# EAGLE design mowbot (EAGLE 7.6.0)

## Sheet 1 of 2
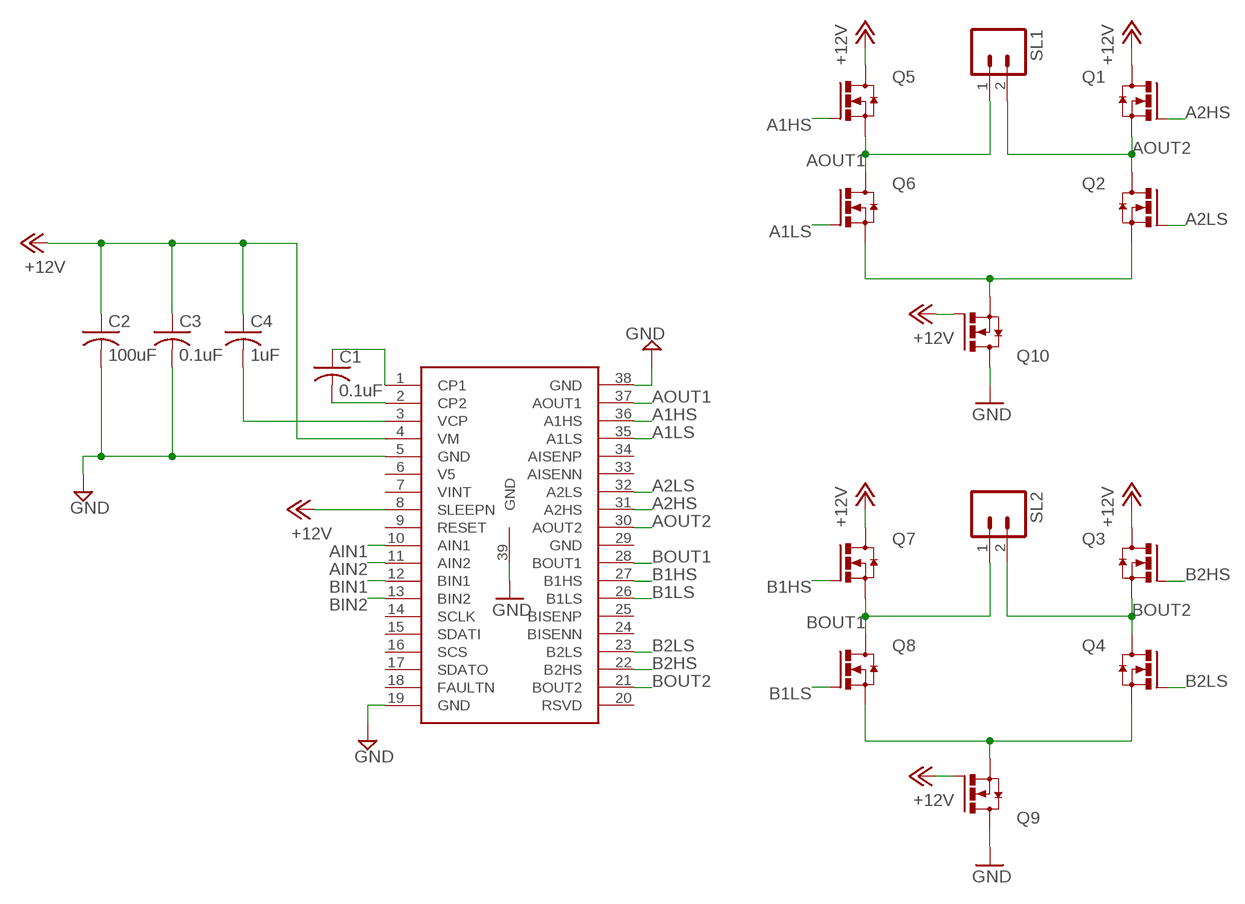
[diagram p0: schematic, sheet 1]

### Parts
C1  0.1uF  C-USC0603  [C0603]
C2  100uF  C-USC0603  [C0603]
C3  0.1uF  C-USC0603  [C0603]
C4  1uF  C-USC0603  [C0603]
Q1  PSMN9R1-30YL-MOSFET_N  [SOT669]
Q2  PSMN9R1-30YL-MOSFET_N  [SOT669]
Q3  PSMN9R1-30YL-MOSFET_N  [SOT669]
Q4  PSMN9R1-30YL-MOSFET_N  [SOT669]
Q5  PSMN9R1-30YL-MOSFET_N  [SOT669]
Q6  PSMN9R1-30YL-MOSFET_N  [SOT669]
Q7  PSMN9R1-30YL-MOSFET_N  [SOT669]
Q8  PSMN9R1-30YL-MOSFET_N  [SOT669]
Q9  PSMN9R1-30YL-MOSFET_N  [SOT669]
Q10  PSMN9R1-30YL-MOSFET_N  [SOT669]
SL1  M02  [02P]
SL2  M02  [02P]
U$1  DRV8704-HBRIDGE_DRIVER  [DRV8704-HBRIDGE-DRIVER]

### Nets
+12V: C2.1 C3.1 C4.1 Q1.MB(D) Q3.MB(D) Q5.MB(D) Q7.MB(D) Q9.4(G) Q10.4(G) U$1.4(VM) U$1.8(SLEEPN) ; also sheet 2
A1HS: Q5.4(G) U$1.36(A1HS)
A1LS: Q6.4(G) U$1.35(A1LS)
A2HS: Q1.4(G) U$1.31(A2HS)
A2LS: Q2.4(G) U$1.32(A2LS)
AIN1: U$1.10(AIN1) ; also sheet 2
AIN2: U$1.11(AIN2) ; also sheet 2
AOUT1: Q5.1(S) Q5.2(S) Q5.3(S) Q6.MB(D) SL1.1 U$1.37(AOUT1)
AOUT2: Q1.1(S) Q1.2(S) Q1.3(S) Q2.MB(D) SL1.2 U$1.30(AOUT2)
B1HS: Q7.4(G) U$1.27(B1HS)
B1LS: Q8.4(G) U$1.26(B1LS)
B2HS: Q3.4(G) U$1.22(B2HS)
B2LS: Q4.4(G) U$1.23(B2LS)
BIN1: U$1.12(BIN1) ; also sheet 2
BIN2: U$1.13(BIN2) ; also sheet 2
BOUT1: Q7.1(S) Q7.2(S) Q7.3(S) Q8.MB(D) SL2.1 U$1.28(BOUT1)
BOUT2: Q3.1(S) Q3.2(S) Q3.3(S) Q4.MB(D) SL2.2 U$1.21(BOUT2)
GND: C2.2 C3.2 Q9.MB(D) Q10.MB(D) U$1.5(GND) U$1.19(GND) U$1.38(GND) U$1.39(GND) ; also sheet 2
N$1: C1.2 U$1.2(CP2)
N$2: C4.2 U$1.3(VCP)
N$3: C1.1 U$1.1(CP1)
N$4: Q4.1(S) Q4.2(S) Q4.3(S) Q8.1(S) Q8.2(S) Q8.3(S) Q9.1(S) Q9.2(S) Q9.3(S)
N$9: Q2.1(S) Q2.2(S) Q2.3(S) Q6.1(S) Q6.2(S) Q6.3(S) Q10.1(S) Q10.2(S) Q10.3(S)
Unconnected: U$1.6(V5) U$1.7(VINT) U$1.9(RESET) U$1.14(SCLK) U$1.15(SDATI) U$1.16(SCS) U$1.17(SDATO) U$1.18(FAULTN) U$1.20(RSVD) U$1.24(BISENN) U$1.25(BISENP) U$1.29(GND) U$1.33(AISENN) U$1.34(AISENP)

## Sheet 2 of 2
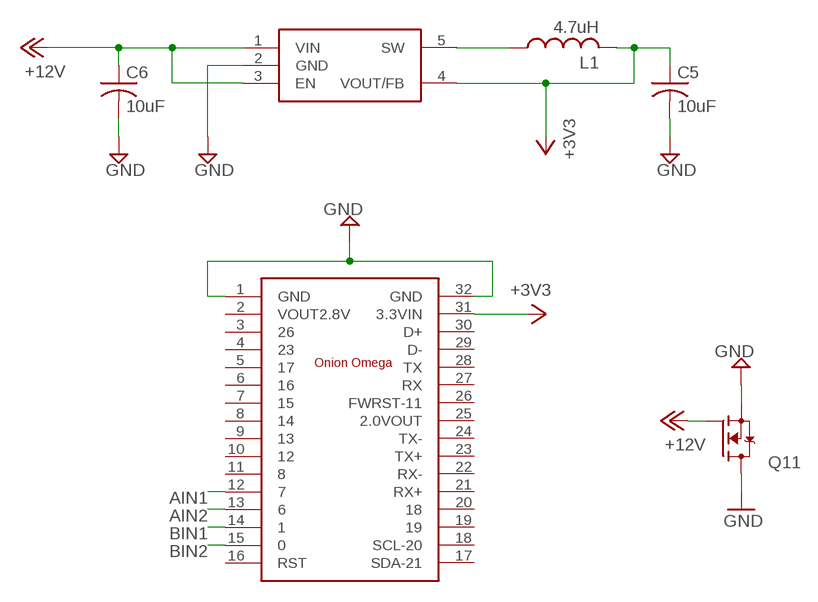
[diagram p1: schematic, sheet 2]

### Parts
C5  10uF  C-USC0603  [C0603]
C6  10uF  C-USC0603  [C0603]
L1  4.7uH  L-USL1812  [L1812]
Q11  DMG2302UK-NMOSFET  [SOT23]
U$2  ONION_OMEGA  [ONION_OMEGA]
U$3  PAM2305  [SOT23-5]

### Nets
+3V3: C5.1 L1.2 U$2.31(3.3VIN) U$3.4(VOUT/FB)
+12V: C6.1 Q11.1(G) U$3.1(VIN) U$3.3(EN) ; also sheet 1
AIN1: U$2.12 ; also sheet 1
AIN2: U$2.13 ; also sheet 1
BIN1: U$2.14 ; also sheet 1
BIN2: U$2.15 ; also sheet 1
GND: C5.2 C6.2 Q11.2(S) Q11.3(D) U$2.1(GND) U$2.32(GND) U$3.2(GND) ; also sheet 1
N$5: L1.1 U$3.5(SW)
Unconnected: U$2.2(VOUT2.8V) U$2.3 U$2.4 U$2.5 U$2.6 U$2.7 U$2.8 U$2.9 U$2.10 U$2.11 U$2.16(RST) U$2.17(SDA-21) U$2.18(SCL-20) U$2.19 U$2.20 U$2.21(RX+) U$2.22(RX-) U$2.23(TX+) U$2.24(TX-) U$2.25(2.0VOUT) U$2.26(FWRST-11) U$2.27(RX) U$2.28(TX) U$2.29(D-) U$2.30(D+)

## Library data of the parts
C1-C6 = rcl:C-US: CAPACITOR, American symbol
L1 = rcl:L-US: INDUCTOR, American symbol
Q1-Q10 = PSMN9R1-30YL_MOSFET_N:PSMN9R1-30YL-MOSFET_N
Q11 = DMG2302UK_NMOSFET:DMG2302UK-NMOSFET
SL1 SL2 = con-amp-quick:M02: AMP QUICK CONNECTOR; OC_FARNELL: unknown; OC_NEWARK: unknown
U$1 = drv8704-hbridge:DRV8704-HBRIDGE_DRIVER
U$2 = onion_omega:ONION_OMEGA
U$3 = pam2305_buck_reg:PAM2305

## Board
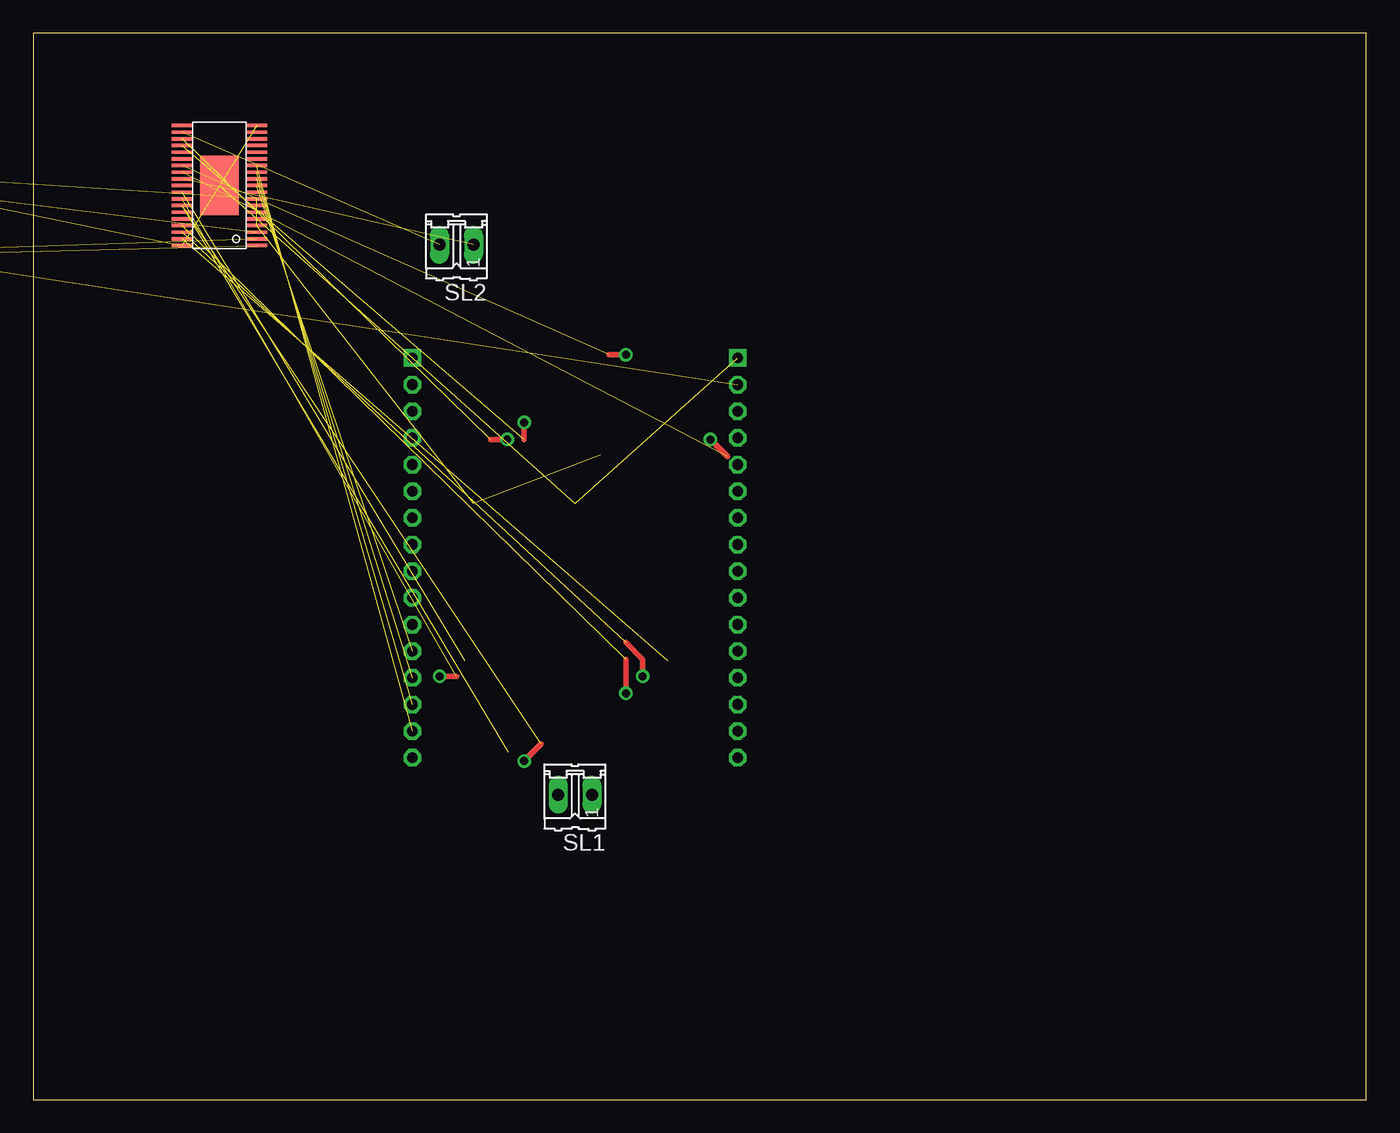
[diagram p2: board, top side]
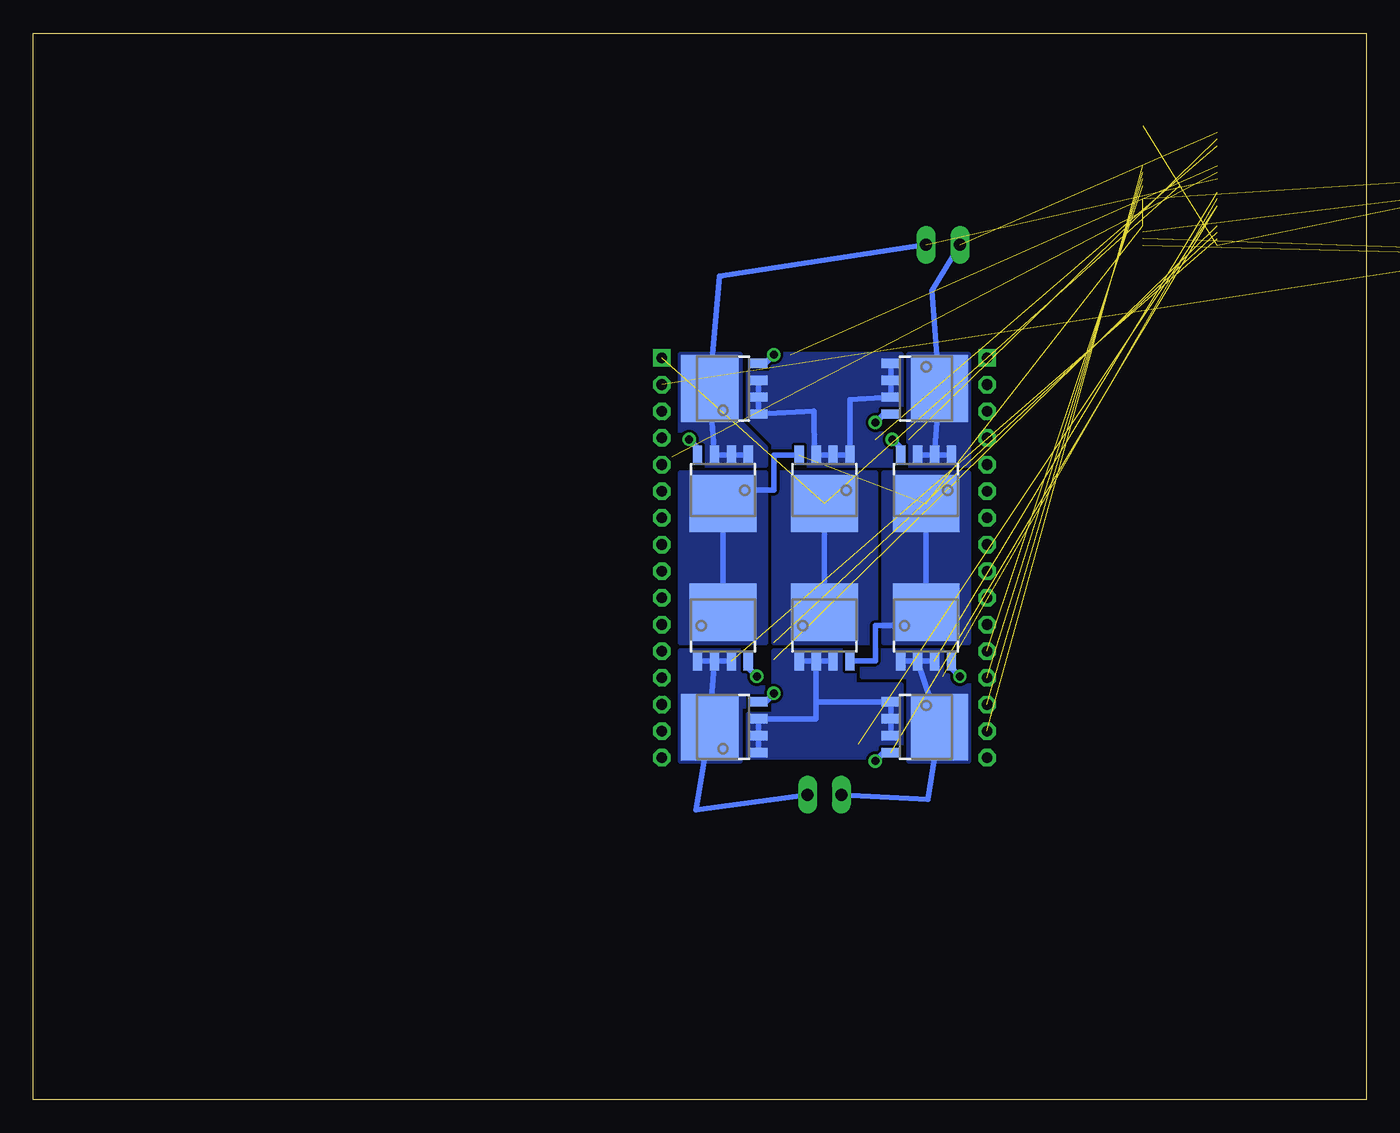
[diagram p3: board, bottom side, seen from below]

Size 100 x 80 mm. Coordinates in mm from the lower left corner, seen from the top.
Outline: 0,0 100,0 100,80 0,80 0,0
Copper layers (1*16): Top 0.035mm / dielectric 1.5mm / Bottom 0.035mm
Design rules "default": minimum track width 10mil, minimum drill 24mil, track to track 8mil, track to pad 8mil, pad to pad 8mil, via to via 8mil, smd to smd 8mil, copper to edge 40mil, drill to drill 8mil, minimum pad ring 10mil, minimum via ring 8mil, stop-mask expansion 4mil, vias tented up to drill 0mil, thermal gap 10mil

### Footprints (pad centres in the part's own frame; a part is rotated, then mirrored left to right if it is on the bottom)
C0603 = smd 1.1 x 1: 1 -0.85,0; 2 0.85,0
L1812 = smd 1.9 x 3.4: 1 -1.95,0; 2 1.95,0
SOT669 = smd 0.7 x 1.4: 1 -1.905,-2.65; 2 -0.635,-2.65; 3 0.635,-2.65; 4 1.905,-2.65 | smd 5 x 4.3: MB 0,1
SOT23 = smd 1 x 1.4: 1 -0.95,-1.1; 2 0.95,-1.1; 3 0,1.1
02P = drill 0.914 long: 1 -1.27,0; 2 1.27,0
DRV8704-HBRIDGE-DRIVER = smd 1.55 x 0.25: 1 -2.8,4.5; 2 -2.8,4; 3 -2.8,3.5; 4 -2.8,3; 5 -2.8,2.5; 6 -2.8,2; 7 -2.8,1.5; 8 -2.8,1; 9 -2.8,0.5; 10 -2.8,0; 11 -2.8,-0.5; 12 -2.8,-1; 13 -2.8,-1.5; 14 -2.8,-2; 15 -2.8,-2.5; 16 -2.8,-3; 17 -2.8,-3.5; 18 -2.8,-4; 19 -2.8,-4.5; 20 2.8,-4.5; 21 2.8,-4; 22 2.8,-3.5; 23 2.8,-3; 24 2.8,-2.5; 25 2.8,-2; 26 2.8,-1.5; 27 2.8,-1; 28 2.8,-0.5; 29 2.8,0; 30 2.8,0.5; 31 2.8,1; 32 2.8,1.5; 33 2.8,2; 34 2.8,2.5; 35 2.8,3; 36 2.8,3.5; 37 2.8,4; 38 2.8,4.5 | smd 2.9 x 4.48: 39 0,0
ONION_OMEGA = drill 0.8 square: 1 -12.2,15; 32 12.2,15 | drill 0.8 octagon: 2 -12.2,13; 3 -12.2,11; 4 -12.2,9; 5 -12.2,7; 6 -12.2,5; 7 -12.2,3; 8 -12.2,1; 9 -12.2,-1; 10 -12.2,-3; 11 -12.2,-5; 12 -12.2,-7; 13 -12.2,-9; 14 -12.2,-11; 15 -12.2,-13; 16 -12.2,-15; 17 12.2,-15; 18 12.2,-13; 19 12.2,-11; 20 12.2,-9; 21 12.2,-7; 22 12.2,-5; 23 12.2,-3; 24 12.2,-1; 25 12.2,1; 26 12.2,3; 27 12.2,5; 28 12.2,7; 29 12.2,9; 30 12.2,11; 31 12.2,13
SOT23-5 = smd 0.5 x 1: 1 -0.95,-1.2; 2 0,-1.2; 3 0.95,-1.2; 4 0.95,1.2; 5 -0.95,1.2

### Placement (x,y rotation side)
C1  -54.61,62.23 0 top  (outside the outline)
C2  -48.26,62.23 0 top  (outside the outline)
C3  -60.96,62.23 0 top  (outside the outline)
C4  -22.86,69.85 0 top  (outside the outline)
C5  -67.31,62.23 0 top  (outside the outline)
C6  -17.78,69.85 0 top  (outside the outline)
L1  -26.67,63.5 0 top  (outside the outline)
Q1  33.02,35.56 0 bottom
Q2  33.02,27.94 270 bottom
Q3  33.02,45.72 180 bottom
Q4  33.02,53.34 270 bottom
Q5  48.26,35.56 0 bottom
Q6  48.26,27.94 90 bottom
Q7  48.26,45.72 180 bottom
Q8  48.26,53.34 90 bottom
Q9  40.64,45.72 180 bottom
Q10  40.64,35.56 0 bottom
Q11  -74.93,-15.24 0 top  (outside the outline)
SL1  40.64,22.86 180 top
SL2  31.75,64.14 180 top
U$1  13.97,68.58 180 top
U$2  40.64,40.64 0 top
U$3  -20.32,63.5 0 top  (outside the outline)

### Tracks (layer width: path | path; a pad name or v marks a point on that pad's centre or on a via)
+3V3  (3 unrouted)
+12V  (10 unrouted)
  Bottom 0.406: Q5.MB Q7.MB 48.26,45.72 44.45,45.72 44.45,48.37 Q9.4 | Q3.MB Q1.MB 33.02,35.56 36.83,35.56 36.83,32.91 Q10.4
  pour Bottom (no thermals): 36.2,46.99 36.2,34.29 29.84,34.29 29.84,46.99
  pour Bottom (no thermals): 45.09,46.99 45.09,34.29 51.44,34.29 51.44,46.99
A1HS  (via drill 0.6)  (1 unrouted)
  Top 0.406: v45.72,31.75 45.72,33.02 44.45,34.29
  Bottom 0.406: Q5.4 46.35,32.38 v45.72,31.75
A1LS  (via drill 0.6)  (1 unrouted)
  Top 0.406: v44.45,30.48 44.45,33.02
  Bottom 0.406: Q6.4 45.09,29.84 v44.45,30.48
A2HS  (via drill 0.6)  (1 unrouted)
  Top 0.406: v30.48,31.75 31.75,31.75
  Bottom 0.406: Q1.4 31.11,32.38 v30.48,31.75
A2LS  (via drill 0.6)  (2 unrouted)
  Top 0.406: v36.83,25.4 38.1,26.67
  Bottom 0.406: Q2.4 36.2,26.04 v36.83,25.4
AIN1  (1 unrouted)
AIN2  (1 unrouted)
AOUT1  (1 unrouted)
  Bottom 0.406: SL1.1 50.27,21.74 49.35,27.37 | 49.35,27.37 Q6.MB | Q5.3 Q5.2 | Q5.2 Q5.1 | Q5.2 49.35,27.37
  pour Bottom (no thermals): 51.44,25.4 46.99,25.4 46.99,29.21 46.99,29.53 44.13,29.53 44.13,33.66 51.44,33.66
AOUT2  (1 unrouted)
  Bottom 0.406: Q1.2 Q2.MB 32.88,22.54 SL1.2 | Q1.2 Q1.3 | Q1.2 Q1.1
  pour Bottom (no thermals): 34.29,25.4 29.84,25.4 29.84,33.66 37.78,33.66 37.78,31.75 34.29,31.75
B1HS  (via drill 0.6)  (1 unrouted)
  Top 0.406: v50.8,49.53 52.07,48.26
  Bottom 0.406: Q7.4 50.16,48.9 v50.8,49.53
B1LS  (via drill 0.6)  (1 unrouted)
  Top 0.406: v44.45,55.88 43.18,55.88
  Bottom 0.406: Q8.4 45.09,55.24 v44.45,55.88
B2HS  (via drill 0.6)  (1 unrouted)
  Top 0.406: v35.56,49.53 34.29,49.53
  Bottom 0.406: Q3.4 34.92,48.9 v35.56,49.53
B2LS  (via drill 0.6)  (1 unrouted)
  Top 0.406: v36.83,50.8 36.83,49.53
  Bottom 0.406: Q4.4 36.2,51.44 v36.83,50.8
BIN1  (1 unrouted)
BIN2  (1 unrouted)
BOUT1  (1 unrouted)
  Bottom 0.406: SL2.1 48.53,61.79 Q8.MB Q7.3 Q7.2 Q7.1
  pour Bottom (no thermals): 51.44,55.88 51.44,47.62 45.09,47.62 45.09,48.9 46.99,50.8 46.99,55.88
BOUT2  (1 unrouted)
  Bottom 0.406: SL2.2 32.6,60.69 Q4.MB Q3.2 | Q3.1 Q3.2 | Q3.2 Q3.3
  pour Bottom (no thermals): 29.84,47.62 29.84,55.88 34.29,55.88 34.29,47.62
GND  (13 unrouted)
  Bottom 0.406: 40.64,35.56 Q10.MB Q9.MB
  pour Bottom (no thermals): 36.83,46.99 36.83,34.29 44.45,34.29 44.45,46.99
N$1  (1 unrouted)
N$2  (1 unrouted)
N$3  (1 unrouted)
N$4
  Bottom 0.406: Q9.3 41.4,48.37 | 41.4,48.37 Q9.2 Q9.1 38.73,52.52 Q4.3 Q4.2 Q4.1 | 41.4,48.37 41.44,51.67 Q8.1 Q8.2 Q8.3
  pour Bottom (no thermals): 34.92,55.88 34.92,47.62 44.45,47.62 44.45,49.21 46.35,51.12 46.35,55.88
N$5  (1 unrouted)
N$9
  Bottom 0.406: Q10.3 Q10.2 | Q10.2 Q10.1 | Q2.3 Q2.2 Q2.1 41.27,29.84 | Q6.1 Q6.2 Q6.3 41.27,28.57 41.27,29.84 | 41.27,29.84 Q10.2
  pour Bottom (no thermals): 38.42,33.66 38.42,31.11 34.92,31.11 34.92,25.72 46.35,25.72 46.35,28.89 44.45,28.89 44.45,33.66